# Altium schematic sheet PreampTX.SchDoc: FMC SDR Frontend
size 420 x 297 mm; CheckedBy: -; CompanyName: CERN; DrawnBy: DrawnBy; Organization: CERN; Address1: European Organization for Nuclear Research; Address2: CH-1211 Genčve 23 - Switzerland; Revision: -; SheetNumber: -; SheetTotal: -; EDA_Number: EDA-XXXXX-VX-X; Projet: -; ModifiedBy: -; CreateDate: XX/XX/XXXX; CheckedDate: -; Title2: Preamplifier - PA GND reference; DivGrp: TE/MPE; Designer: Designer; ModifiedDate: -
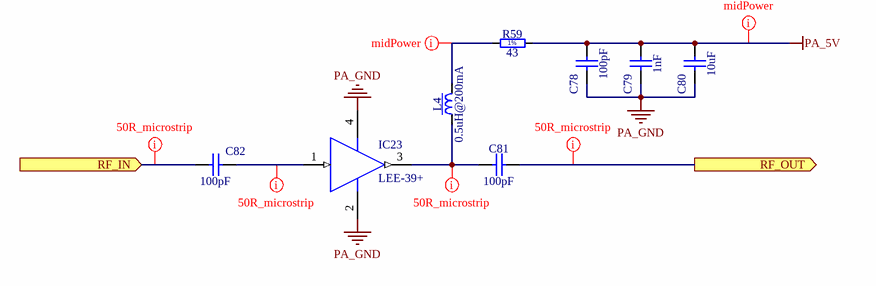
[diagram p0: PreampTX.SchDoc]

## Parts
C78  100pF  [CAPC1005X55N]
C79  1nF  [CAPC1005X55N]
C80  10uF  [CAPC3216X180N]
C81  100pF  [CAPC1005X55N]
C82  100pF  [CAPC1005X55N]
IC23  LEE-39+  [MINI-CIRCUITS_FG873]
L4  0.5uH@200mA  [IND_MINI-CIRCUITS_GU1604]
R59  43  [RESC1608X55N]

## Ports
RF_IN (in), RF_OUT (out)

## Nets
PA_5V: C78.2 C79.2 C80.2 R59.2
PA_GND: C78.1 C79.1 C80.1 IC23.2(GND) IC23.4(GND)
RF_IN: C82.1 ; port RF_IN
RF_OUT: C81.2 ; port RF_OUT
NetC81_1: C81.1 IC23.3(RF_OUT) L4.1
NetC82_2: C82.2 IC23.1(RF_IN)
NetL4_3: L4.3 R59.1

## Layout directives
net class midPower: NetL4_3, PA_5V
net class 50R_class: NetC82_2, RF_IN, RF_OUT
net class 50R_class; rule Clearance Constraint [Generic clearance = 0.15mm, and 26 value(s) for objects]: NetC81_1

## Notes on the sheet
- Project/Equipment
- Document
- Designer
- Drawn by
- Check.by
- File
- Last Mod.
- Print Date
- Sheet
- Size
- A3
- of
- Rev
- (in symbol R0603_43R_1%_0.1W_100PPM) 1%

## Library data of the parts
C78 C81 C82 = CC0402_100PF_50V_5%_C0G: Non-polarised capacitor; Part Description: SMD Multilayer Chip Ceramic Capacitor; Manufacturer: GENERIC; Manufacturer1 Part Number: C0402C101J5GACTU; Voltage: 50V; TC: C0G/NP0; Tolerance: ±5%; Part Number: CC0402_100PF_50V_5%_C0G; Component Kind: Standard; Component Type: Standard; Pin Count: 2; Value: 100pF; Status: Preferred; Manufacturer Part Number: CC0402_100PF_50V_5%_C0G; Case: 0402; Mounted: Yes; Socket: No; SMD: Yes; Sense: No; Manufacturer1 Example: KEMET; Manufacturer1 ComponentHeight: 0.55mm; HelpURL: \\cern.ch\dfs\Applications\Altium\Datasheets\CC0805_C0G_KEMET_(Commercial Grade).pdf; Author: CERN DEM JLC; CreateDate: 03.12.2007; LatestRevisionDate: 22.04.2015
C79 = CC0402_1NF_50V_10%_X7R: Non-polarised capacitor; Part Description: SMD Multilayer Chip Ceramic Capacitor; Manufacturer: GENERIC; Manufacturer1 Part Number: 223858715623; Voltage: 50V; TC: X7R; Tolerance: ±10%; Part Number: CC0402_1NF_50V_10%_X7R; Component Kind: Standard; Component Type: Standard; Pin Count: 2; Value: 1nF; Status: Not Recommended; Manufacturer Part Number: CC0402_1NF_50V_10%_X7R; Case: 0402; Mounted: Yes; Socket: No; SMD: Yes; Sense: No; Manufacturer1 Example: PHYCOMP; Manufacturer1 ComponentHeight: 0.55mm; HelpURL: \\cern.ch\dfs\Applications\Altium\Datasheets\CC0402_X7R_PHYCOMP.pdf; Author: CERN DEM JLC; CreateDate: 03.12.2007; LatestRevisionDate: 03.12.2007
C80 = CC1206_10UF_25V_10%_X7R: Non-polarised capacitor; Part Description: SMD Multilayer Chip Ceramic Capacitor; Manufacturer: GENERIC; Manufacturer1 Part Number: C1206C106K4RACTU; Voltage: 25V; TC: X7R; Tolerance: ±10%; Part Number: CC1206_10UF_25V_10%_X7R; Component Kind: Standard; Component Type: Standard; Pin Count: 2; Value: 10uF; Status: Preferred; Manufacturer Part Number: CC1206_10uF_25V_10%_X7R; Case: 1206; Mounted: Yes; Socket: No; SMD: Yes; Sense: No; Manufacturer1 Example: KEMET; Manufacturer1 ComponentHeight: 1.8mm; HelpURL: \\cern.ch\dfs\Applications\Altium\Datasheets\CC1206_X7R_KEMET.pdf; Author: CERN DEM JLC; CreateDate: 12.09.2012; LatestRevisionDate: 12.09.2012
IC23 = LEE-39+: Monolithic Amplifier; Part Description: DC-8GHz Monolithic Amplifier; Manufacturer: MINI-CIRCUITS; PressFit: No; Bonding: No; Part Number: LEE-39+; Component Kind: Standard; Component Type: Standard; Device: LEE-39+; PackageDescription: MINI-CIRCUITS FG873 Case, 4 pin, 3.0mm W X 3.0mm L; Manufacturer Part Number: LEE-39+; Pin Count: 4; Mounted: Yes; Socket: No; SMD: Yes; Sense: No; ComponentHeight: 0.89mm; Author: CERN DEM JLC; HelpURL: \\cern.ch\dfs\Applications\Altium\Datasheets\LEE-39+.pdf; ComponentLink1URL: \\cern.ch\dfs\Applications\Altium\Datasheets\LEE-39+_Package-Drawing.pdf; ComponentLink1Description: Package Drawing; CreateDate: 17.01.2017; LatestRevisionDate: 17.01.2017
L4 = IND_MINI-CIRCUITS_TCCH-80+: 50 Ohms, 50 to 8200 MHz RF Choke; Power: 200mA; Resistance: 0.1R; Part Number: IND_MINI-CIRCUITS_TCCH-80+; Component Kind: Standard; Component Type: Standard; Pin Count: 4; Value: 0.5uH@200mA; Status: None; Part Description: 50 Ohms, 50 to 8200 MHz RF Choke; Manufacturer: MINI-CIRCUITS; Manufacturer Part Number: TCCH-80+; Mounted: Yes; Socket: No; SMD: Yes; Sense: No; ComponentHeight: 3.81mm; HelpURL: \\cern.ch\dfs\Applications\Altium\Datasheets\IND_MINI-CIRCUITS_TCCH-80+.pdf; Author: CERN DEM JLC; CreateDate: 19.12.2011; LatestRevisionDate: 19.12.2011
R59 = R0603_43R_1%_0.1W_100PPM: Resistor - 1%; Part Description: General Purpose Thick Film Chip Resistor; Manufacturer: GENERIC; Manufacturer1 Part Number: NRC06F43R0TRF; Power: 0.1W; TC: ±100ppm/°C; PressFit: No; Part Number: R0603_43R_1%_0.1W_100PPM; Component Kind: Standard; Component Type: Standard; Pin Count: 2; Value: 43; Status: Preferred; Tolerance: ±1%; Manufacturer Part Number: R0603_43R_1%_0.1W_100PPM; Case: 0603; Mounted: Yes; Sense: No; Socket: No; SMD: Yes; Manufacturer1 Example: NIC COMPONENT; Manufacturer1 ComponentHeight: 0.55mm; HelpURL: \\cern.ch\dfs\Applications\Altium\Datasheets\R0603_NIC_NRC.pdf; Author: CERN DEM JLC; CreateDate: 03.12.2007; LatestRevisionDate: 13.03.2008